# EAGLE design glowhacker_rev_a (EAGLE 7.3.0)
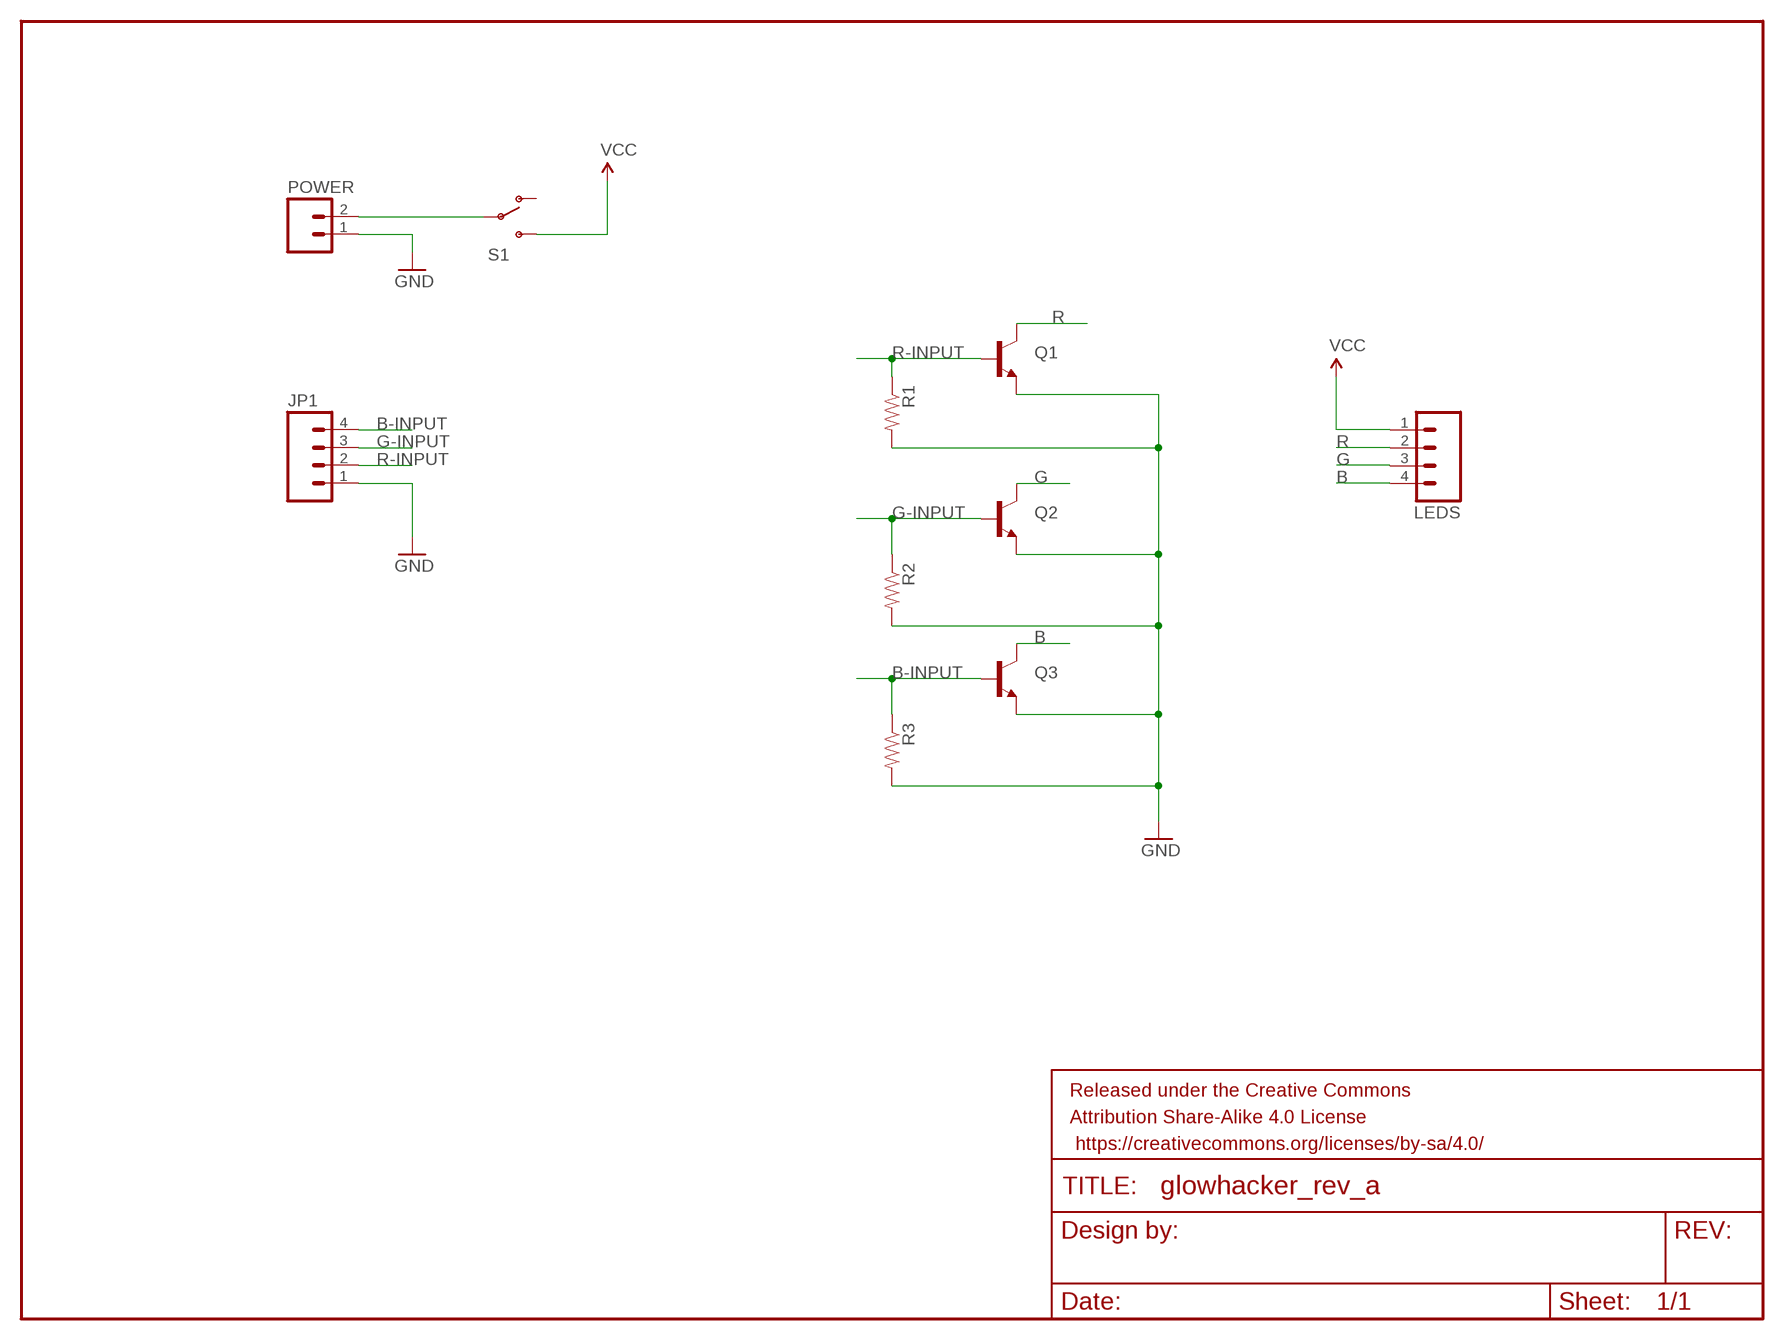
[diagram p0: schematic, sheet 1]

## Parts
FRAME1  FRAME-LETTER  [CREATIVE_COMMONS]
JP1  M04PTH  [1X04]
LEDS  M04PTH  [1X04]
POWER  M02PTH  [1X02]
Q1  TRANSISTOR_NPNTO-92-AMMO  [TO-92-AMMO]
Q2  TRANSISTOR_NPNTO-92-AMMO  [TO-92-AMMO]
Q3  TRANSISTOR_NPNTO-92-AMMO  [TO-92-AMMO]
R1  RESISTOREZ  [AXIAL-0.3EZ]
R2  RESISTOREZ  [AXIAL-0.3EZ]
R3  RESISTOREZ  [AXIAL-0.3EZ]
S1  SWITCH-SPDTPTH  [SWITCH-SPDT]

## Nets
B: LEDS.4 Q3.3(C)
B-INPUT: JP1.4 Q3.2(B) R3.P$1
G: LEDS.3 Q2.3(C)
G-INPUT: JP1.3 Q2.2(B) R2.P$1
GND: JP1.1 POWER.1 Q1.1(E) Q2.1(E) Q3.1(E) R1.P$2 R2.P$2 R3.P$2
N$1: POWER.2 S1.2(P)
R: LEDS.2 Q1.3(C)
R-INPUT: JP1.2 Q1.2(B) R1.P$1
VCC: LEDS.1 S1.3(S)
Unconnected: S1.1(O)

## Library data of the parts
FRAME1 = SparkFun-Aesthetics:FRAME-LETTER: Schematic Frame Standard 8.5x11 US Letter frame
JP1 LEDS = SparkFun-Connectors:M04: Header 4 Standard 4-pin 0.1" header. Use with straight break away headers (SKU : PRT-00116), right angle break away headers (PRT-00553), swiss pins (PRT-00743), machine pins (PRT-00117), and female headers (PRT-00115). Molex polarized connector foot print use with SKU : PRT-08231 with associated crimp pins and housings. 1MM SMD Version SKU: PRT-10208
POWER = SparkFun-Connectors:M02: Standard 2-pin 0.1" header. Use with - straight break away headers ( PRT-00116) - right angle break away headers (PRT-00553) - swiss pins (PRT-00743) - machine pins (PRT-00117) - female headers (PRT-00115) Molex polarized connector foot print use with: PRT-08233 with associated crimp pins and housings. 2.54_SCREWTERM for use with PRT-10571. 3.5mm Screw Terminal footprints for PRT-08084 5mm Screw Terminal footprints for use with PRT-08432
Q1-Q3 = SparkFun-DiscreteSemi:TRANSISTOR_NPN: Generic NPN BJT MMBT2222A - TRANS-08049 (SOT-23, 1A 40V) MPSA42 - TRANS-09116 (SOT-23, 500mA 300V) MMBT5088LT1G - TRANS-11160 (SOT-23, 50 mA 30V) BC547 - COM-08928 <http://www.sparkfun.com/products/8928> (TO-92 45V 100mA) (1.Collector 2.Base 3.Emitter) 2N3904 - COM-00521 <http://www.sparkfun.com/products/521> (TO-92 40V 200mA) (1.Emitter 2.Base 3.Collector) P2N2222A - COM-12852 <http://www.sparkfun.com/products/12852> (TO-92 40V 600mA) (1.Collector 2.Base 3.Emitter)
R1-R3 = SparkFun-Passives:RESISTOR: Resistor Basic schematic elements and footprints for 0603, 1206, and PTH resistors.
S1 = SparkFun-Electromechanical:SWITCH-SPDT: SPDT Switch Simple slide switch, Spark Fun Electronics SKU : COM-00102 DPDT SMT slide switch, AYZ0202, SWCH-08179; PROD_ID: SWCH-08261

## Board
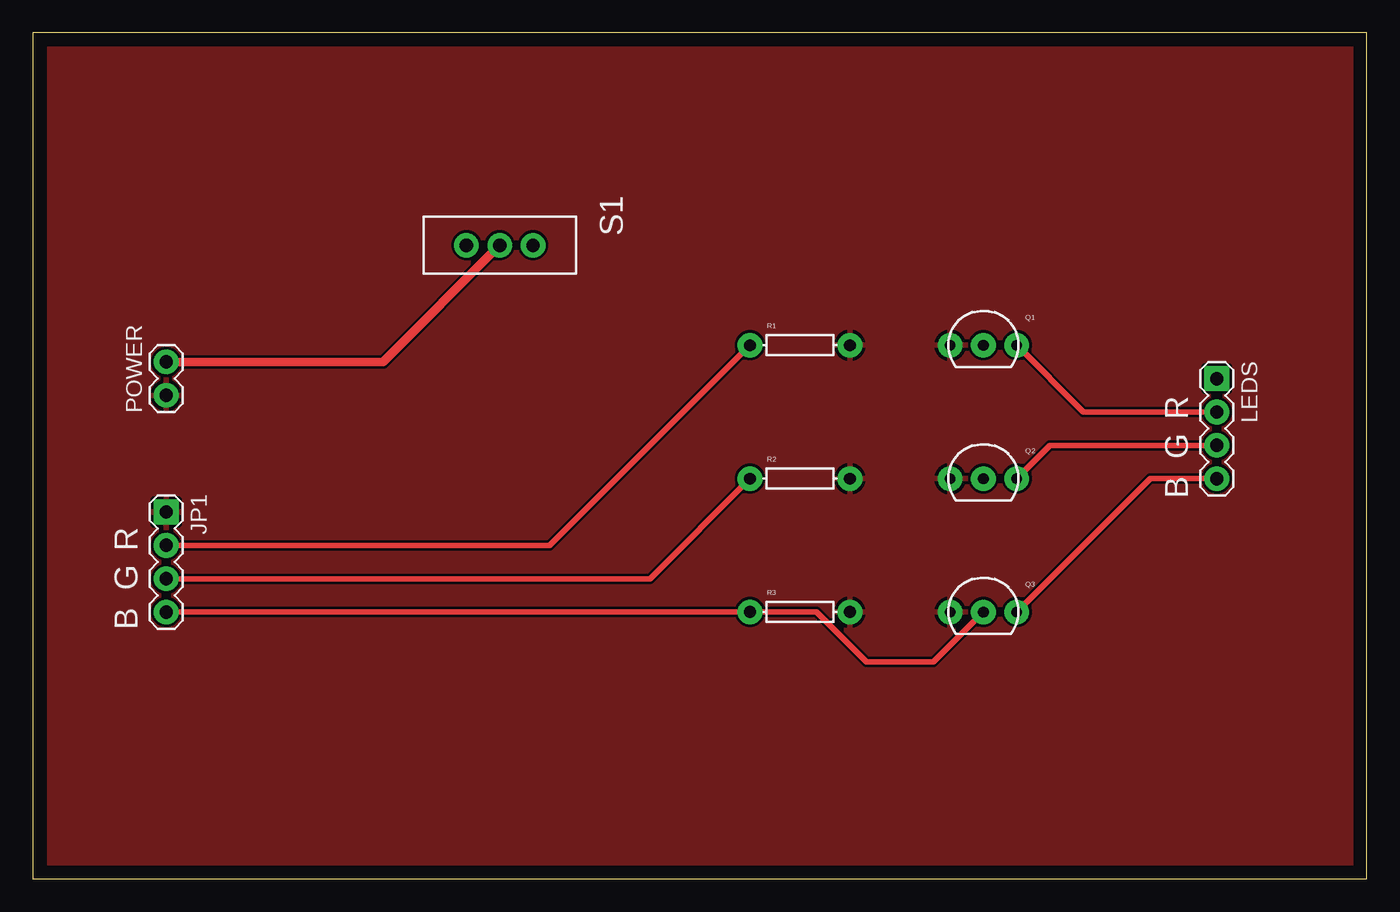
[diagram p1: board, top side]
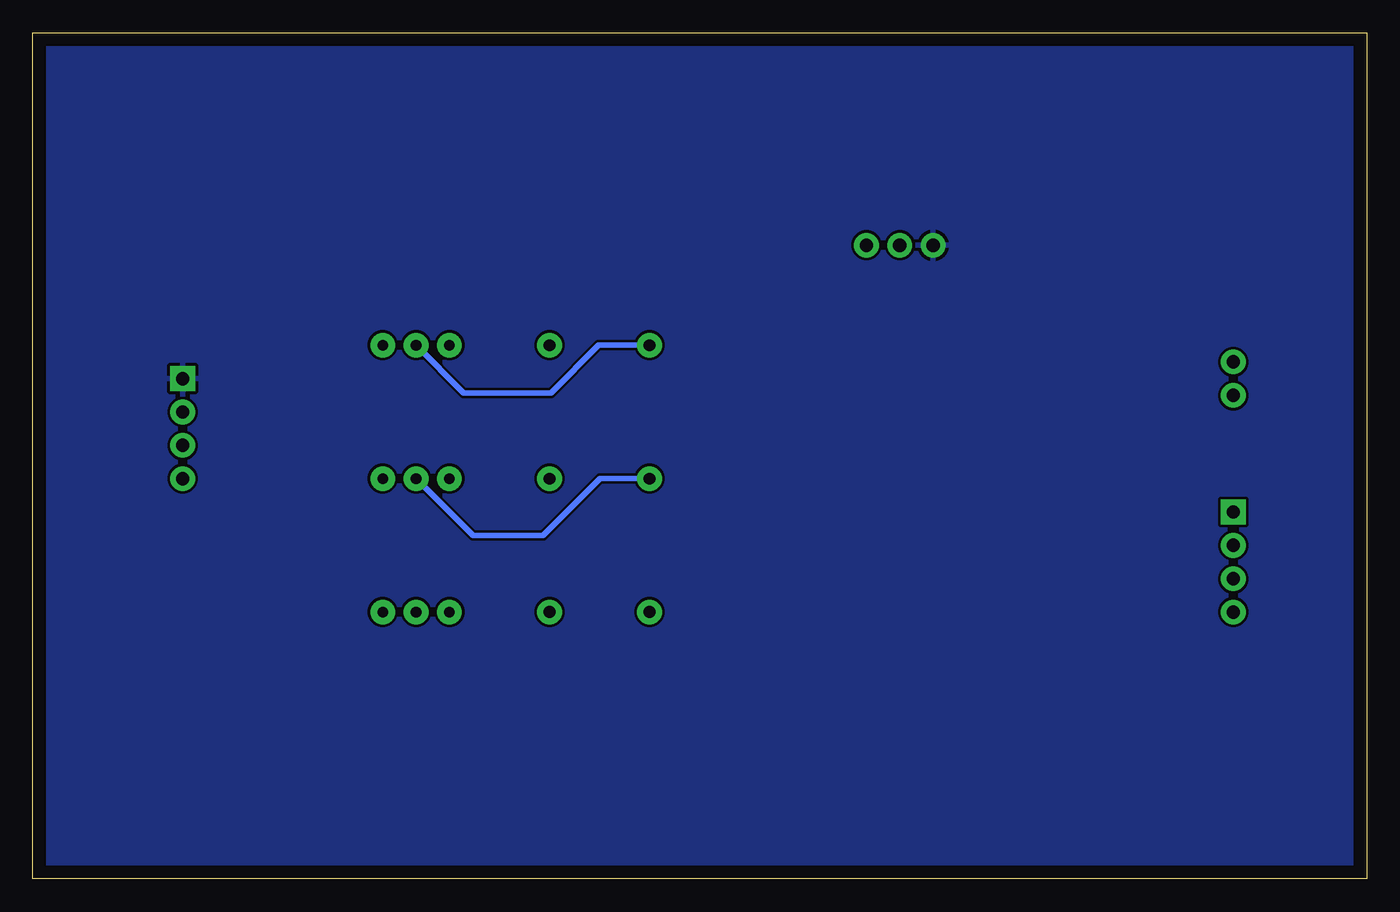
[diagram p2: board, bottom side, seen from below]

Size 101.58 x 64.44 mm. Coordinates in mm from the lower left corner, seen from the top.
Outline: 0,0 101.58,0 101.58,64.44 0,64.44 0,0
Copper layers (1*16): Top 0.035mm / dielectric 1.5mm / Bottom 0.035mm
Design rules "default": minimum track width 10mil, minimum drill 24mil, track to track 8mil, track to pad 8mil, pad to pad 8mil, via to via 8mil, smd to smd 8mil, copper to edge 40mil, drill to drill 8mil, minimum pad ring 10mil, minimum via ring 8mil, stop-mask expansion 4mil, vias tented up to drill 0mil, thermal gap 10mil

### Footprints (pad centres in the part's own frame; a part is rotated, then mirrored left to right if it is on the bottom)
1X04 = drill 1.016 pad 1.88 square: 1 0,0 | drill 1.016 pad 1.88: 2 2.54,0; 3 5.08,0; 4 7.62,0
1X02 = drill 1.016 pad 1.88: 1 0,0; 2 2.54,0
TO-92-AMMO = drill 0.813 pad 1.88: 1 -2.54,0; 2 0,0; 3 2.54,0
AXIAL-0.3EZ = drill 0.9 pad 1.88: P$1 -3.81,0; P$2 3.81,0
SWITCH-SPDT = drill 1.016 pad 1.88: 1 0,2.54; 2 0,0; 3 0,-2.54

### Placement (x,y rotation side)
FRAME1  15.24,-24.13 0 top  (outside the outline)
JP1  10.16,27.94 270 top
LEDS  90.17,38.1 270 top
POWER  10.16,36.83 90 top
Q1  72.39,40.64 0 top
Q2  72.39,30.48 0 top
Q3  72.39,20.32 0 top
R1  58.42,40.64 0 top
R2  58.42,30.48 0 top
R3  58.42,20.32 0 top
S1  35.56,48.26 270 top

### Tracks (layer width: path | path; a pad name or v marks a point on that pad's centre or on a via)
B
  Top 0.406: Q3.3 85.09,30.48 LEDS.4
B-INPUT
  Top 0.406: JP1.4 R3.P$1 59.69,20.32 63.5,16.51 68.58,16.51 Q3.2
G
  Top 0.406: Q2.3 77.47,33.02 LEDS.3
G-INPUT
  Top 0.406: JP1.3 46.99,22.86 R2.P$1
  Bottom 0.406: R2.P$1 58.37,30.48 62.71,26.14 68.05,26.14 Q2.2
GND
  pour Top: 1.27,63.5 101.6,63.5 101.6,0 1.27,0
N$1
  Top 0.635: POWER.2 26.67,39.37 S1.2
R
  Top 0.406: Q1.3 80.01,35.56 LEDS.2
R-INPUT
  Top 0.406: JP1.2 39.37,25.4 R1.P$1
  Bottom 0.406: R1.P$1 58.5,40.64 62.13,37.01 68.76,37.01 Q1.2
VCC
  pour Bottom: 0,64.77 101.6,64.77 101.6,0 0,0

### Text on the board
tPlace: R | G | B | R | G | B